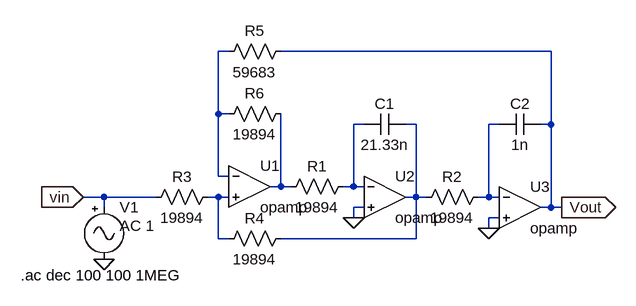
[diagram p0: schematic Schema.asc]
Schema.asc, the LTspice schematic file:
Version 4
SHEET 1 880 680
WIRE 80 -112 64 -112
WIRE 576 -112 160 -112
WIRE 64 -16 64 -112
WIRE 80 -16 64 -16
WIRE 288 0 272 0
WIRE 368 0 352 0
WIRE 496 0 480 0
WIRE 576 0 576 -112
WIRE 576 0 560 0
WIRE 64 80 64 -16
WIRE 80 80 64 80
WIRE 160 96 160 -16
WIRE 160 96 144 96
WIRE 176 96 160 96
WIRE 272 96 272 0
WIRE 272 96 256 96
WIRE 288 96 272 96
WIRE -112 112 -144 112
WIRE -32 112 -112 112
WIRE 64 112 48 112
WIRE 80 112 64 112
WIRE 368 112 368 0
WIRE 368 112 352 112
WIRE 384 112 368 112
WIRE 480 112 480 0
WIRE 480 112 464 112
WIRE 496 112 480 112
WIRE -112 128 -112 112
WIRE 288 128 272 128
WIRE 576 128 576 0
WIRE 576 128 560 128
WIRE 592 128 576 128
WIRE 272 144 272 128
WIRE 496 144 480 144
WIRE 480 160 480 144
WIRE 64 176 64 112
WIRE 80 176 64 176
WIRE 368 176 368 112
WIRE 368 176 160 176
FLAG -144 112 vin
IOPIN -144 112 In
FLAG 592 128 Vout
IOPIN 592 128 Out
FLAG 272 144 0
FLAG 480 160 0
FLAG -112 208 0
SYMBOL res 64 96 R90
WINDOW 0 0 56 VBottom 2
WINDOW 3 32 56 VTop 2
SYMATTR InstName R3
SYMATTR Value 19894
SYMBOL res 272 80 R90
WINDOW 0 0 56 VBottom 2
WINDOW 3 32 56 VTop 2
SYMATTR InstName R1
SYMATTR Value 19894
SYMBOL res 480 96 R90
WINDOW 0 0 56 VBottom 2
WINDOW 3 32 56 VTop 2
SYMATTR InstName R2
SYMATTR Value 19894
SYMBOL cap 560 -16 R90
WINDOW 0 0 32 VBottom 2
WINDOW 3 32 32 VTop 2
SYMATTR InstName C2
SYMATTR Value 1n
SYMBOL cap 352 -16 R90
WINDOW 0 0 32 VBottom 2
WINDOW 3 32 32 VTop 2
SYMATTR InstName C1
SYMATTR Value 21.33n
SYMBOL res 176 -32 R90
WINDOW 0 0 56 VBottom 2
WINDOW 3 32 56 VTop 2
SYMATTR InstName R6
SYMATTR Value 19894
SYMBOL res 176 160 R90
WINDOW 0 0 56 VBottom 2
WINDOW 3 32 56 VTop 2
SYMATTR InstName R4
SYMATTR Value 19894
SYMBOL res 176 -128 R90
WINDOW 0 0 56 VBottom 2
WINDOW 3 32 56 VTop 2
SYMATTR InstName R5
SYMATTR Value 59683
SYMBOL Misc\\signal -112 112 R0
WINDOW 123 24 44 Left 2
WINDOW 39 0 0 Left 2
SYMATTR Value2 AC 1
SYMATTR InstName V1
SYMATTR Value ""
SYMBOL Opamps\\opamp 112 32 R0
SYMATTR InstName U1
SYMBOL Opamps\\opamp 320 48 R0
SYMATTR InstName U2
SYMBOL Opamps\\opamp 528 64 R0
SYMATTR InstName U3
TEXT -240 232 Left 2 !.ac dec 100 100 1MEG

The netlist it stands for:
* Schema.asc
R3 N006 vin 19894
R1 N002 N005 19894
R2 N004 N003 19894
C2 Vout N004 1n
C1 N003 N002 21.33n
R6 N005 N001 19894
R4 N003 N006 19894
R5 Vout N001 59683
V1 vin 0 AC 1
XU1 N001 N006 N005 opamp Aol=100K GBW=10Meg  ; pins invin noninvin out
XU2 N002 0 N003 opamp Aol=100K GBW=10Meg  ; pins invin noninvin out
XU3 N004 0 Vout opamp Aol=100K GBW=10Meg  ; pins invin noninvin out
.ac dec 100 100 1MEG
.backanno
.end